# EAGLE design SK_1.0v (EAGLE 7.5.0)
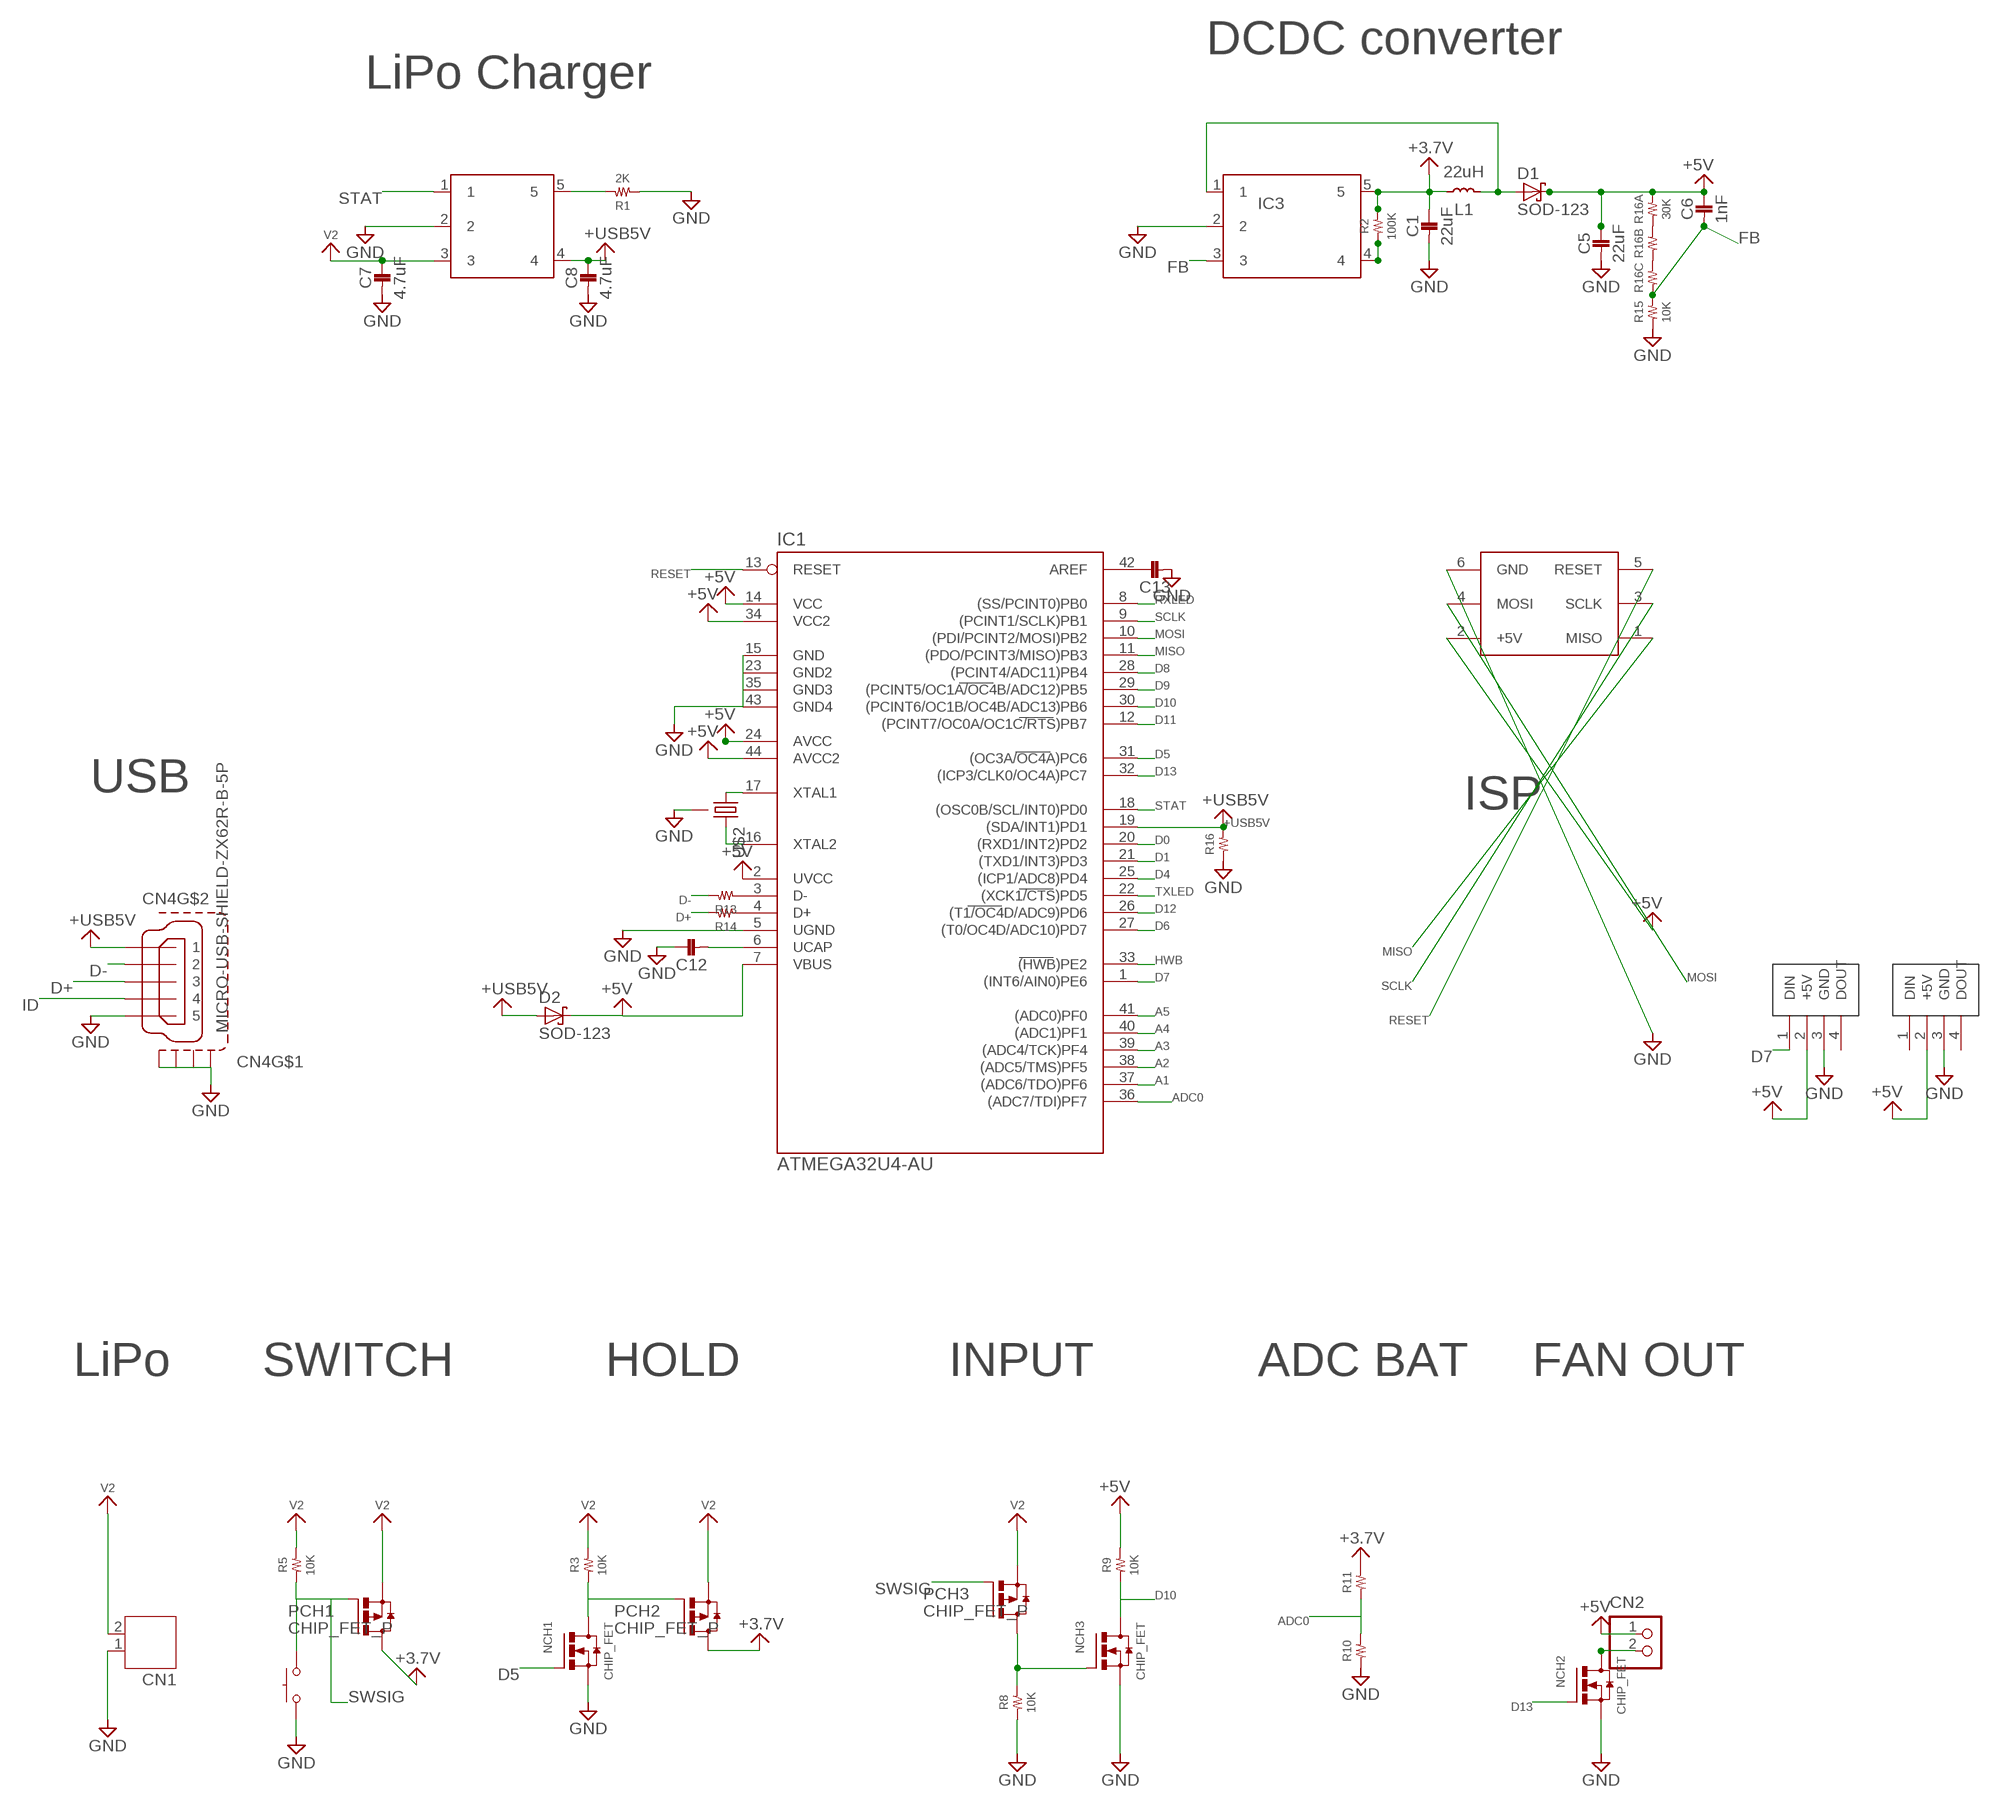
[diagram p0: schematic, sheet 1]

## Parts
C1  22uF  1608  [1608]
C5  22uF  1608  [1608]
C6  1nF  1608  [1608]
C7  4.7uF  1608  [1608]
C8  4.7uF  1608  [1608]
C12  1608  [1608]
C13  1608  [1608]
CN1  JST-PH2  [JST-PH2]
CN2  B2B-PH-K-S  [B2B-PH-K-S]
CN4  MICRO-USB-SHIELD-ZX62R-B-5P  [ZX62R-B-5P]
D1  SOD-123  [SOD_123]
D2  SOD-123  [SOD_123]
IC1  ATMEGA32U4-AU  [TQFP44]
IC2  MCP73831  [SOT23-5L]
IC3  LM2735  [SOT23-5L]
L1  22uH  KYORITU  [KYORITU]
LED1  NEO5MM  [NEO5MM]
LED2  NEO5MM  [NEO5MM]
NCH1  CHIP_FET  [SOT23]
NCH2  CHIP_FET  [SOT23]
NCH3  CHIP_FET  [SOT23]
PCH1  CHIP_FET_P  [SOT23]
PCH2  CHIP_FET_P  [SOT23]
PCH3  CHIP_FET_P  [SOT23]
R1  2K  RESISTOR__SMD  [1608]
R2  100K  RESISTOR__SMD  [1608]
R3  10K  RESISTOR__SMD  [1608]
R5  10K  RESISTOR__SMD  [1608]
R8  10K  RESISTOR__SMD  [1608]
R9  10K  RESISTOR__SMD  [1608]
R10  RESISTOR__SMD  [1608]
R11  RESISTOR__SMD  [1608]
R13  RESISTOR__SMD  [1608]
R14  RESISTOR__SMD  [1608]
R15  10K  RESISTOR__SMD  [1608]
R16  RESISTOR__SMD  [1608]
R16A  30K  RESISTOR__SMD  [1608]
R16B  RESISTOR__SMD  [1608]
R16C  RESISTOR__SMD  [1608]
U$2  CSTCE  [CSTCE]
U$3  ICSP  [ICSP]
U$5  B3U-3000P  [B3U-3000]

## Nets
+3.7V: C1.P$1 IC3.5 L1.P$1 PCH1.3(D) PCH2.3(D) R2.2 R11.2
+5V: C5.P$1 C6.P$1 CN2.1 D1.C D2.C IC1.2(UVCC) IC1.7(VBUS) IC1.14(VCC) IC1.24(AVCC) IC1.34(VCC2) IC1.44(AVCC2) LED1.2(+5V) LED2.2(+5V) R9.2 R16A.2 U$3.2(+5V)
+USB5V: C8.P$1 CN4.1 D2.A IC1.19((SDA/INT1)PD1) IC2.4 R16.2
A1: IC1.37((ADC6/TDO)PF6)
A2: IC1.38((ADC5/TMS)PF5)
A3: IC1.39((ADC4/TCK)PF4)
A4: IC1.40((ADC1)PF1)
A5: IC1.41((ADC0)PF0)
ADC0: IC1.36((ADC7/TDI)PF7) R10.2 R11.1
D0: IC1.20((RXD1/INT2)PD2)
D1: IC1.21((TXD1/INT3)PD3)
D4: IC1.25((ICP1/ADC8)PD4)
D5: IC1.31((OC3A/OC4A)PC6) NCH1.1(G)
D6: IC1.27((T0/OC4D/ADC10)PD7)
D7: IC1.1((INT6/AIN0)PE6) LED1.1(DIN)
D8: IC1.28((PCINT4/ADC11)PB4)
D9: IC1.29((PCINT5/OC1A/OC4B/ADC12)PB5)
D10: IC1.30((PCINT6/OC1B/OC4B/ADC13)PB6) NCH3.3(D) R9.1
D11: IC1.12((PCINT7/OC0A/OC1C/RTS)PB7)
D12: IC1.26((T1/OC4D/ADC9)PD6)
D13: IC1.32((ICP3/CLK0/OC4A)PC7) NCH2.1(G)
D+: CN4.3 R14.2
D-: CN4.2 R13.2
FB: C6.P$2 IC3.3 R15.2 R16C.1
GND: C1.P$2 C5.P$2 C7.P$2 C8.P$2 C12.P$1 C13.P$2 CN1.1 CN4.5 CN4.M1(S1) CN4.M2(S2) CN4.M3(S3) CN4.M4(S4) IC1.5(UGND) IC1.15(GND) IC1.23(GND2) IC1.35(GND3) IC1.43(GND4) IC2.2 IC3.2 LED1.3(GND) LED2.3(GND) NCH1.2(S) NCH2.2(S) NCH3.2(S) R1.1 R8.1 R10.1 R15.1 R16.1 U$2.P$2 U$3.6(GND) U$5.P$2
HWB: IC1.33((HWB)PE2)
ID: CN4.4
MISO: IC1.11((PDO/PCINT3/MISO)PB3) U$3.1(MISO)
MOSI: IC1.10((PDI/PCINT2/MOSI)PB2) U$3.4(MOSI)
N$1: CN2.2 NCH2.3(D)
N$2: IC2.5 R1.2
N$3: IC3.4 R2.1
N$4: D1.A IC3.1 L1.P$2
N$5: R16A.1 R16B.2
N$6: NCH1.3(D) PCH2.1(G) R3.1
N$7: IC1.16(XTAL2) U$2.P$3
N$8: IC1.3(D-) R13.1
N$9: C13.P$1 IC1.42(AREF)
N$10: IC1.17(XTAL1) U$2.P$1
N$11: R16B.1 R16C.2
N$14: IC1.4(D+) R14.1
N$18: C12.P$2 IC1.6(UCAP)
RESET: IC1.13(RESET) U$3.5(RESET)
RXLED: IC1.8((SS/PCINT0)PB0)
SCLK: IC1.9((PCINT1/SCLK)PB1) U$3.3(SCLK)
SIG: NCH3.1(G) PCH3.3(D) R8.2
STAT: IC1.18((OSC0B/SCL/INT0)PD0) IC2.1
SWSIG: PCH1.1(G) PCH3.1(G) R5.1 U$5.P$1
TXLED: IC1.22((XCK1/CTS)PD5)
V2 [POWER]: C7.P$1 CN1.2 IC2.3 PCH1.2(S) PCH2.2(S) PCH3.2(S) R3.2 R5.2
Unconnected: LED1.4(DOUT) LED2.1(DIN) LED2.4(DOUT)

## Notes on the sheet
- DCDC converter
- LiPo Charger
- USB
- ISP
- LiPo | SWITCH | HOLD | INPUT | ADC BAT | FAN OUT

## Library data of the parts
C1 C5-C8 C12 C13 = 02_C:1608
CN1 = jst-ph (1):JST-PH2
CN2 = jst-ph:B2B-PH-*: Wire-to-Board 2.0mm pitch top mount connector Source: http://www.jst-mfg.com/product/pdf/jpn/PH.pdf http://www.jst-mfg.com/product/detail.php?series=199
CN4 = con-hirose1:MICRO-USB-SHIELD-: Hirose Micro USB Connector ZX62R-B-5P: Micro B, reverse (top mount) shell SMT Supplier: DigiKey H11574CT-ND Source: http://www.hirose.co.jp/cataloge_hp/e24200011.pdf
D1 D2 = 15_DIODE:SOD-123
IC1 = mega32U4:ATMEGA32U4-AU
IC2 = 04_IC:MCP73831
IC3 = 04_IC:LM2735
L1 = 03_L:KYORITU
LED1 LED2 = 10_LED:NEO5MM
NCH1-NCH3 = 06_FET:CHIP_FET
PCH1-PCH3 = 06_FET:CHIP_FET_P
R1-R3 R5 R8-R11 R13-R16 R16A R16B R16C = 01_R:RESISTOR__SMD
U$2 = 09_2_CRYSTAL:CSTCE
U$3 = 08_CONECTOR:ICSP
U$5 = 09_1_switch:B3U-3000P

## Board
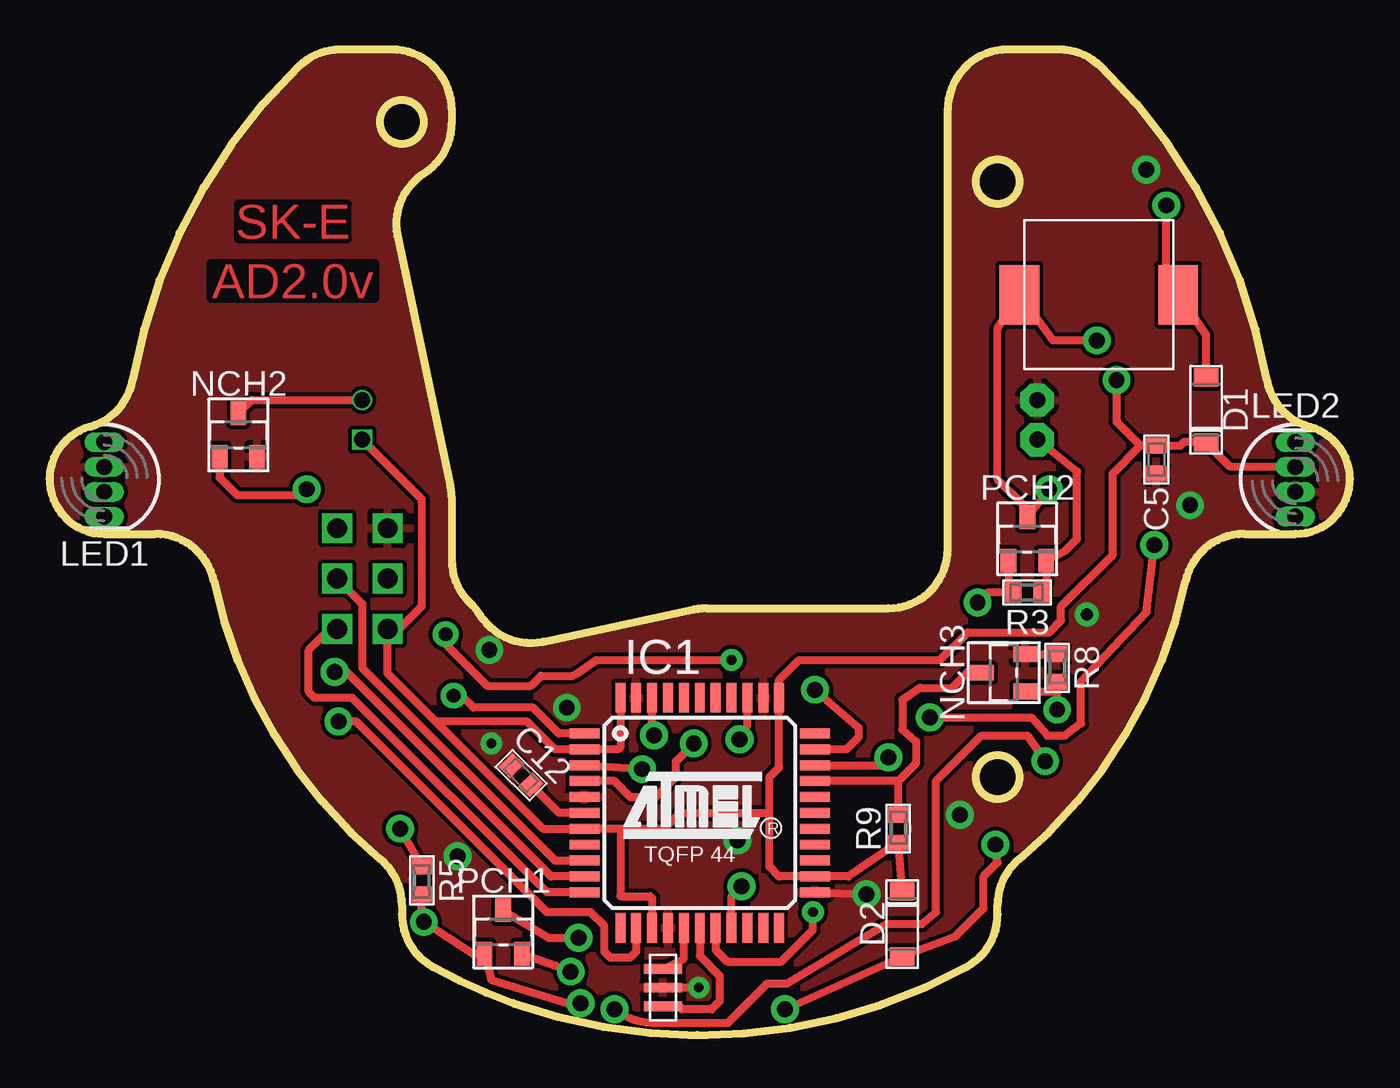
[diagram p1: board, top side]
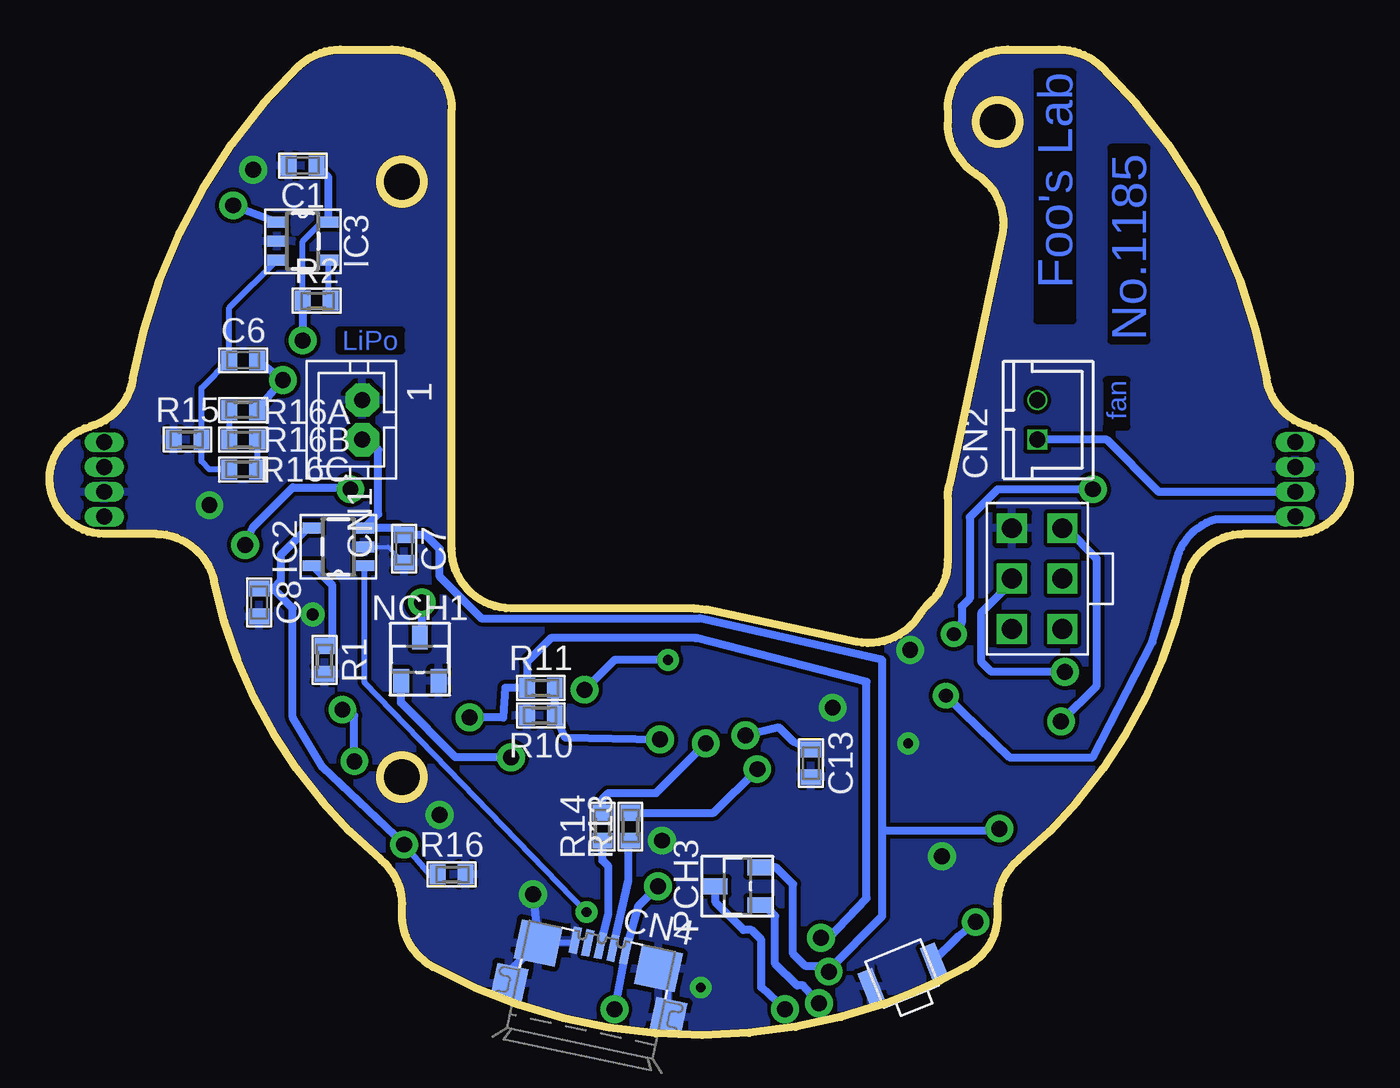
[diagram p2: board, bottom side, seen from below]

Size 65.5 x 49.65 mm. Coordinates in mm from the lower left corner, seen from the top.
Outline: 17.52,40.24 17.52,40.24
Outline: 17.52,40.24 20.18,27.71 arc-12 20.25,27.08 20.25,23.94 arc47 21.2,21.75 arc-15 21.69,21.16 arc70 24.85,19.82 32.44,21.43 arc-12 33.06,21.5 42.25,21.5 arc90 45.25,24.5 45.25,46.65 arc-90 48.25,49.65 50.86,49.65 arc-44 52.95,48.8 arc-36 61.31,33.03 arc65 63.47,30.65 arc-165 62.75,25.25 60.15,25.25 arc78 57.22,22.87 arc-38 48.82,8.85 arc50 47.75,6.55 47.75,6.07 arc-61 46.19,3.44 arc-48 23.37,1.62 arc-9 19.31,3.44 arc-61 17.75,6.07 17.75,6.55 arc50 16.68,8.85 arc-38 8.28,22.87 arc78 5.35,25.25 2.75,25.25 arc-165 2.02,30.65 arc65 4.19,33.03 arc-36 12.54,48.8 arc-44 14.63,49.65 17.25,49.65 arc-90 20.25,46.65 20.25,45.94 arc-58 18.85,43.4 arc70 17.52,40.24
Outline: circle at 47.75,43 radius 1.1
Outline: circle at 47.75,13 radius 1.1
Outline: circle at 17.75,46 radius 1.1
Copper layers (1*16): Top 0.035mm / dielectric 1.5mm / Bottom 0.035mm
Design rules "default *": minimum track width 0.2mm, minimum drill 0.4mm, track to track 0.2mm, track to pad 0.2mm, pad to pad 0.2mm, via to via 0.2mm, smd to smd 0.2mm, copper to edge 1mil, drill to drill 8mil, minimum pad ring 0.1mm, minimum via ring 0.3mm, stop-mask expansion 4mil, vias tented up to drill 0mil, thermal gap 10mil
Holes 2.2 mm at 47.75,13 47.75,43

### Footprints (pad centres in the part's own frame; a part is rotated, then mirrored left to right if it is on the bottom)
1608 = smd 0.8 x 1: P$1 -0.7,0; P$2 0.7,0
JST-PH2 = drill 0.8 pad 1.676 octagon: 1 1,0; 2 -1,0
B2B-PH-K-S = drill 0.8 square: 1 -1,0 | drill 0.8: 2 1,0
ZX62R-B-5P = smd 1.35 x 0.4: 1 2.875,-1.3; 2 2.875,-0.65; 3 2.875,0; 4 2.875,0.65; 5 2.875,1.3 | smd 1.8 x 1.6: M1 0.05,-4.1; M2 0.05,4.1 | smd 2 x 2.1: M3 2.35,3.1; M4 2.35,-3.1
SOD_123 = smd 0.915 x 1.22: A -1.64,0; C 1.64,0
TQFP44 = smd 1.5 x 0.5: 1 -5.8,4; 2 -5.8,3.2; 3 -5.8,2.4; 4 -5.8,1.6; 5 -5.8,0.8; 6 -5.8,0; 7 -5.8,-0.8; 8 -5.8,-1.6; 9 -5.8,-2.4; 10 -5.8,-3.2; 11 -5.8,-4; 23 5.8,-4; 24 5.8,-3.2; 25 5.8,-2.4; 26 5.8,-1.6; 27 5.8,-0.8; 28 5.8,0; 29 5.8,0.8; 30 5.8,1.6; 31 5.8,2.4; 32 5.8,3.2; 33 5.8,4 | smd 0.5 x 1.5: 12 -4,-5.8; 13 -3.2,-5.8; 14 -2.4,-5.8; 15 -1.6,-5.8; 16 -0.8,-5.8; 17 0,-5.8; 18 0.8,-5.8; 19 1.6,-5.8; 20 2.4,-5.8; 21 3.2,-5.8; 22 4,-5.8; 34 4,5.8; 35 3.2,5.8; 36 2.4,5.8; 37 1.6,5.8; 38 0.8,5.8; 39 0,5.8; 40 -0.8,5.8; 41 -1.6,5.8; 42 -2.4,5.8; 43 -3.2,5.8; 44 -4,5.8
SOT23-5L = smd 0.55 x 1: 1 -0.95,-1.3; 2 0,-1.3; 3 0.95,-1.3; 4 0.95,1.3; 5 -0.95,1.3
KYORITU = smd 2 x 3: P$1 -4,0; P$2 4,0
NEO5MM = drill 0.8 pad 0.89 long: 1 0,1.875; 2 0,0.625; 3 0,-0.625; 4 0,-1.875
SOT23 = smd 0.8 x 1.2: 1 -0.95,-1.1; 2 0.95,-1.1; 3 0,1.1
1608' = smd 0.8 x 1: 1 -0.7,0; 2 0.7,0
CSTCE = smd 0.5 x 1.9: P$1 -0.95,0; P$2 0,0; P$3 0.95,0
ICSP = drill 1 pad 1.5 square: 1 -1.27,2.54; 2 1.27,2.54; 3 -1.27,0; 4 1.27,0; 5 -1.27,-2.54; 6 1.27,-2.54
B3U-3000 = smd 0.8 x 1.7: P$1 -1.7,0; P$2 1.7,0

### Placement (x,y rotation side)
C1  52.75,43.8 180 bottom
C5  55.75,29 270 top
C6  55.75,34 180 bottom
C7  47.65,24.5 270 bottom
C8  54.95,21.8 270 bottom
C12  23.75,13.1 315 top
C13  27.15,13.7 270 bottom
CN1  49.75,31 90 bottom
CN2  15.75,31 90 bottom
CN4  38.35,1.7 78 bottom
D1  58.25,31.5 270 top
D2  42.95,5.6 90 top
IC1  32.75,11.2 0 top
IC2  50.95,24.6 90 bottom
IC3  52.75,40 270 bottom
L1  52.85,37.3 0 top
LED1  2.75,28 180 top
LED2  62.75,28 0 top
NCH1  46.85,18.94 0 bottom
NCH2  9.51,30.24 0 top
NCH3  48.06,18.26 90 top
PCH1  22.85,5.2 0 top
PCH2  49.25,25 0 top
PCH3  30.85,7.5 90 bottom
R1  2K  [1608']  51.65,18.9 90 bottom
R2  100K  [1608']  52.05,37 180 bottom
R3  10K  [1608']  49.25,22.3 0 top
R5  10K  [1608']  18.75,7.8 90 top
R8  10K  [1608']  50.75,18.5 270 top
R9  10K  [1608']  42.75,10.4 270 top
R10  [1608']  40.75,16.1 0 bottom
R11  [1608']  40.75,17.5 180 bottom
R13  [1608']  36.25,10.5 270 bottom
R14  [1608']  37.65,10.5 270 bottom
R15  10K  [1608']  58.55,30 0 bottom
R16  [1608']  45.25,8.1 180 bottom
R16A  30K  [1608']  55.75,31.5 0 bottom
R16B  [1608']  55.75,30 180 bottom
R16C  [1608']  55.75,28.5 0 bottom
U$2  30.9,2.4 90 top
U$3  15.75,23 180 bottom
U$5  22.55,3.1 202 bottom

### Tracks (layer width: path | path; a pad name or v marks a point on that pad's centre or on a via)
+3.7V  (via drill 0.8)
  Top 0.4: v52.75,35 50.55,35 L1.P$1 47.75,35.6 47.75,28 49.15,26.6 PCH2.3 v50.35,27.5 | v55.65,24.7 55.25,21.3 51.95,17.8 51.95,15.7 51.15,15.1 50.25,15.1 49.45,16 v44.35,16 | PCH1.3 25.15,4.9 v26.65,4.9
  Bottom 0.3: R2.2 52.75,40 51.8,40.95 IC3.5
  Bottom 0.4: R2.2 v52.75,35 | IC3.5 51.45,43.2 C1.P$1 | v44.35,16 42.65,16 42.55,17.5 R11.2 41.45,18.8 40.25,20 32.95,20 24.35,17.8 24.35,6.9 26.25,4.9 v26.65,4.9 | v55.65,24.7 55.25,25.6 53.25,27.6 50.65,27.6 v50.35,27.5
+5V  (via drill 0.8)
  Top 0.4: IC1.44 28.75,14.5 28.65,14.4 IC1.2 25.45,14.4 24.05,15.8 19.45,15.8 | 28.75,10.4 28.75,7 30.25,7 30.35,6.9 IC1.14 | D2.C R9.2 40.25,8 IC1.24 36.75,8 36.25,8.5 36.25,11.2 | 36.25,11.2 36.25,13 36.75,13.5 IC1.34 36.75,17.9 37.75,18.9 44.85,18.9 46.25,20.3 50.35,20.3 50.95,20.9 50.95,21.6 53.55,24.2 53.55,28.3 54.95,29.7 | 19.45,15.8 24.85,10.4 IC1.7 28.75,10.4 | 19.45,15.8 17.02,18.23 U$3.2 17.61,20.46 18.75,21.6 18.75,27 CN2.1 | 28.75,10.4 30.95,10.4 31.75,11.2 36.25,11.2 | v53.75,33 53.75,30.9 54.95,29.7 | 54.95,29.7 C5.P$1 56.95,29.7 57.15,29.9 58.05,29.9 D1.C 59.48,28.62 LED2.2
  Bottom 0.4: R16A.2 v53.75,33 C6.P$1 | LED1.2 9.62,27.37 12.25,30 CN2.1
+USB5V  (via drill 0.8)
  Top 0.4: v37.05,1.3 D2.A 45.61,4.96 47.05,6.4 47.05,8 47.75,8.7 v47.65,9.6 | IC1.19 34.35,7 v34.85,7.5
  Bottom 0.3: R16.2 46.35,8.1 v47.65,9.6
  Bottom 0.4: v37.05,1.3 CN4.1 35.85,6.5 v34.85,7.5 | v47.65,9.6 51.75,13.5 53.25,16 53.25,21.5 54.25,22.5 | 54.25,22.5 C8.P$1 | IC2.4 52.5,25.55 53.85,24.2 53.85,22.9 54.25,22.5
ADC0  (via drill 0.8)
  Top 0.4: v34.75,14.9 35.15,15.6 IC1.36
  Bottom 0.4: v34.75,14.9 39.55,15 R10.2 R11.1
D5  (via drill 0.8)
  Top 0.4: IC1.31 41.85,13.6 v42.25,14
  Bottom 0.4: v42.25,14 45.05,14 47.8,16.75 NCH1.1
D7  (via drill 0.7)
  Top 0.4: IC1.1 25.65,15.2 24.35,16.5 21.35,16.5 20.75,17.1 v20.35,17.1
  Bottom 0.4: v20.35,17.1 17.15,14 12.95,14 9.95,19.8 8.7,24.05 arc57 6.75,26 2.75,26 LED1.1
D10
  Top 0.4: 42.75,12.8 IC1.30 | R9.1 42.75,12.8 | 42.75,12.8 43.65,13.7 43.65,14.8 42.95,15.4 42.95,16.9 43.85,17.5 45.45,17.5 46.25,18.3 46.92,18.3 NCH3.3
D13  (via drill 0.5, 0.7, 0.8)
  Top 0.4: NCH2.1 8.56,28.09 9.45,27.2 12.65,27.2 v12.95,27.5 | v34.35,18.9 27.55,18.9 26.55,18.2 26.35,18.1 24.75,18.1 24.25,17.6 22.05,17.6 19.95,19.7 20.05,19.8 v19.95,20.2 | v38.55,17.4 40.75,15.5 40.75,15 40.15,14.4 IC1.32
  Bottom 0.4: v12.95,27.5 17.75,27.5 19.15,26.1 19.15,22 19.55,21.6 19.55,20.8 v19.95,20.2 | v34.35,18.9 37.05,18.9 v38.55,17.4
D+
  Bottom 0.4: CN4.3 37.35,6.1 37.35,8.5 37.65,8.8 R14.2
D-
  Bottom 0.4: CN4.2 36.35,7.8 36.35,9.7 R13.2
FB
  Bottom 0.3: IC3.3 56.45,36.65 C6.P$2 57.85,32.6 R15.2 57.85,28.9 57.45,28.5 R16C.1
GND  (via drill 0.5, 0.6, 0.8)
  Top 0.4: IC1.23 v41.15,7.1 | v26.05,16.5 26.35,16.5 | R8.1 49.27,19.1 NCH3.2 | U$2.P$2 v32.7,2.4
  Bottom 0.2: IC2.2 48.45,24.6 C7.P$2
  Bottom 0.3: CN4.5 39.16,4.64 CN4.M3 | CN4.M1 34.33,2.85 CN4.M4
  Bottom 0.4: CN4.M2 42.35,3.19 CN4.M3 v41.15,7.1 | 25.65,16.5 v26.05,16.5 | v32.7,2.4 32.65,2.6
  other vias: 22.15,19.4 20.55,9 45.85,11.1 55.25,43.6 57.45,26.7 34.65,9.8 22.25,14.7 52.25,21.2
  pour Bottom: -2.25,28 arc90 32.75,-7 arc90 67.75,28 arc90 32.75,63 arc90
  pour Top: -2.25,28 arc90 32.75,-7 arc90 67.75,28 arc90 32.75,63 arc90
MISO
  Top 0.4: IC1.11 25.05,7.2 15.25,17 13.35,17 13.05,17.3 13.05,19.4 14.11,20.46 U$3.1
MOSI  (via drill 0.8)
  Top 0.4: IC1.10 25.25,8 14.95,18.3 v14.35,18.3
  Bottom 0.4: v14.35,18.3 18.05,18.3 18.55,18.8 18.55,21.3 17.02,22.83 U$3.4
N$1
  Top 0.4: NCH2.3 10.17,32 CN2.2
N$2
  Bottom 0.4: IC2.5 51.25,22.65 51.25,19.7 R1.2
N$3
  Bottom 0.3: R2.1 51.45,37.1 IC3.4
N$4  (via drill 0.8)
  Top 0.4: v56.25,41.8 56.25,37.3 L1.P$2 58.25,35.3 D1.A
  Bottom 0.4: IC3.1 v56.25,41.8
N$5
  Bottom 0.3: R16A.1 R16B.2
N$6  (via drill 0.8)
  Top 0.4: PCH2.1 48.3,22.75 R3.1 47.25,22.3 v46.75,21.8
  Bottom 0.4: v46.75,21.8 46.75,20.14 NCH1.3
N$7
  Top 0.4: U$2.P$3 31.95,3.85 IC1.16
N$8  (via drill 0.8)
  Top 0.4: v29.85,13.4 IC1.3
  Bottom 0.4: R13.1 32.05,11.2 v29.85,13.4
N$9  (via drill 0.8)
  Top 0.4: v30.45,15.1 30.35,15.6 IC1.42
  Bottom 0.4: v30.45,15.1 28.75,15.5 28.05,14.8 C13.P$1
N$10
  Top 0.4: IC1.17 32.75,4 33.75,3 33.75,1.7 33.35,1.3 31.85,1.3 31.7,1.45 U$2.P$1
N$11
  Bottom 0.3: R16B.1 R16C.2
N$14  (via drill 0.8)
  Top 0.4: IC1.4 28.45,12.8 29.25,12 30.55,12 31.55,13 31.55,13.8 v32.45,14.7
  Bottom 0.4: R14.1 37.65,11.9 37.35,12.2 34.95,12.2 v32.45,14.7 32.45,14.4
N$18
  Top 0.4: IC1.6 25.65,11.2 C12.P$2
RESET  (via drill 0.8)
  Top 0.4: IC1.13 29.55,4.2 29.25,3.9 28.25,3.9 27.95,4.2 27.95,5.5 27.25,6.2 25.05,6.2 15.45,15.8 v14.55,15.8
  Bottom 0.4: U$3.5 14.29,25.54 12.75,24 12.75,17.6 v14.55,15.8
SCLK
  Top 0.4: U$3.3 15.75,21.73 15.75,18.5 25.45,8.8 IC1.9
SIG  (via drill 0.8)
  Top 0.4: v50.15,13.8 49.25,15.1 46.95,15.1 44.65,12.8 44.65,6.2 43.95,5.6 42.15,5.6 37.15,2.6 36.15,2.6 34.15,0.6 30.65,0.6 arc-40 v28.45,1.3 | v50.75,16.4 50.75,17.2 | 50.75,17.2 R8.2 | NCH3.1 50.64,17.31 50.75,17.2
  Bottom 0.4: v50.15,13.8 50.15,16.1 v50.75,16.4 | v28.45,1.3 29.65,2.4 29.65,4.8 30.15,5.3 30.55,5.3 31.95,6.7 PCH3.3
STAT  (via drill 0.5 pad 0.25)
  Top 0.3: v38.45,6.2 38.45,5.4
  Top 0.4: IC1.18 33.55,4.3 34.15,3.7 36.85,3.7 38.45,5.3 v38.45,6.2
  Bottom 0.3: IC2.1 49.65,17.8 v38.45,6.2
SWSIG  (via drill 0.8, 0.8 pad 1.27)
  Top 0.4: R5.1 18.75,6 v18.85,5.7 21.3,4.1 PCH1.1 22.1,3.35 22.25,2.8 26.45,1.5 v26.75,1.6
  Bottom 0.4: U$5.P$1 19.75,4.96 v18.85,5.7 | v26.75,1.6 27.55,2.5 27.85,2.5 28.95,3.6 28.95,6 29.5,6.55 PCH3.1
V2  (via drill 0.8)
  Top 0.4: PCH1.2 25.5,3.5 v26.25,3.2 | v17.65,10.4 R5.2 | R3.2 50.2,22.75 PCH2.2 51.15,24.4 51.75,25 51.75,28.4 CN1.2
  Bottom 0.4: 26.25,3.3 23.55,6 23.55,10.3 | CN1.2 49.45,30 48.95,29.5 48.95,26.25 IC2.3 48,25.55 C7.P$1 46.55,25.2 45.85,24.5 45.85,23.1 43.75,21 32.75,21 23.55,18.9 23.55,10.3 | 23.55,10.3 17.75,10.3 v17.65,10.4 | 26.25,3.3 26.55,3.5 27.45,3.5 28.05,4.1 28.05,7.6 28.9,8.45 PCH3.2 | 26.25,3.3 v26.25,3.2

### Text on the board
Top: SK-E | AD2.0v
Bottom: Foo's Lab | No.1185 | LiPo | fan